# EasyEDA schematic RC-CAR-Rx.json
TITLE: Sheet_1; REV: 1.0; Date: 2025-01-02; Sheet: 1/1; Drawn By: harsh2003; Company: Your Company
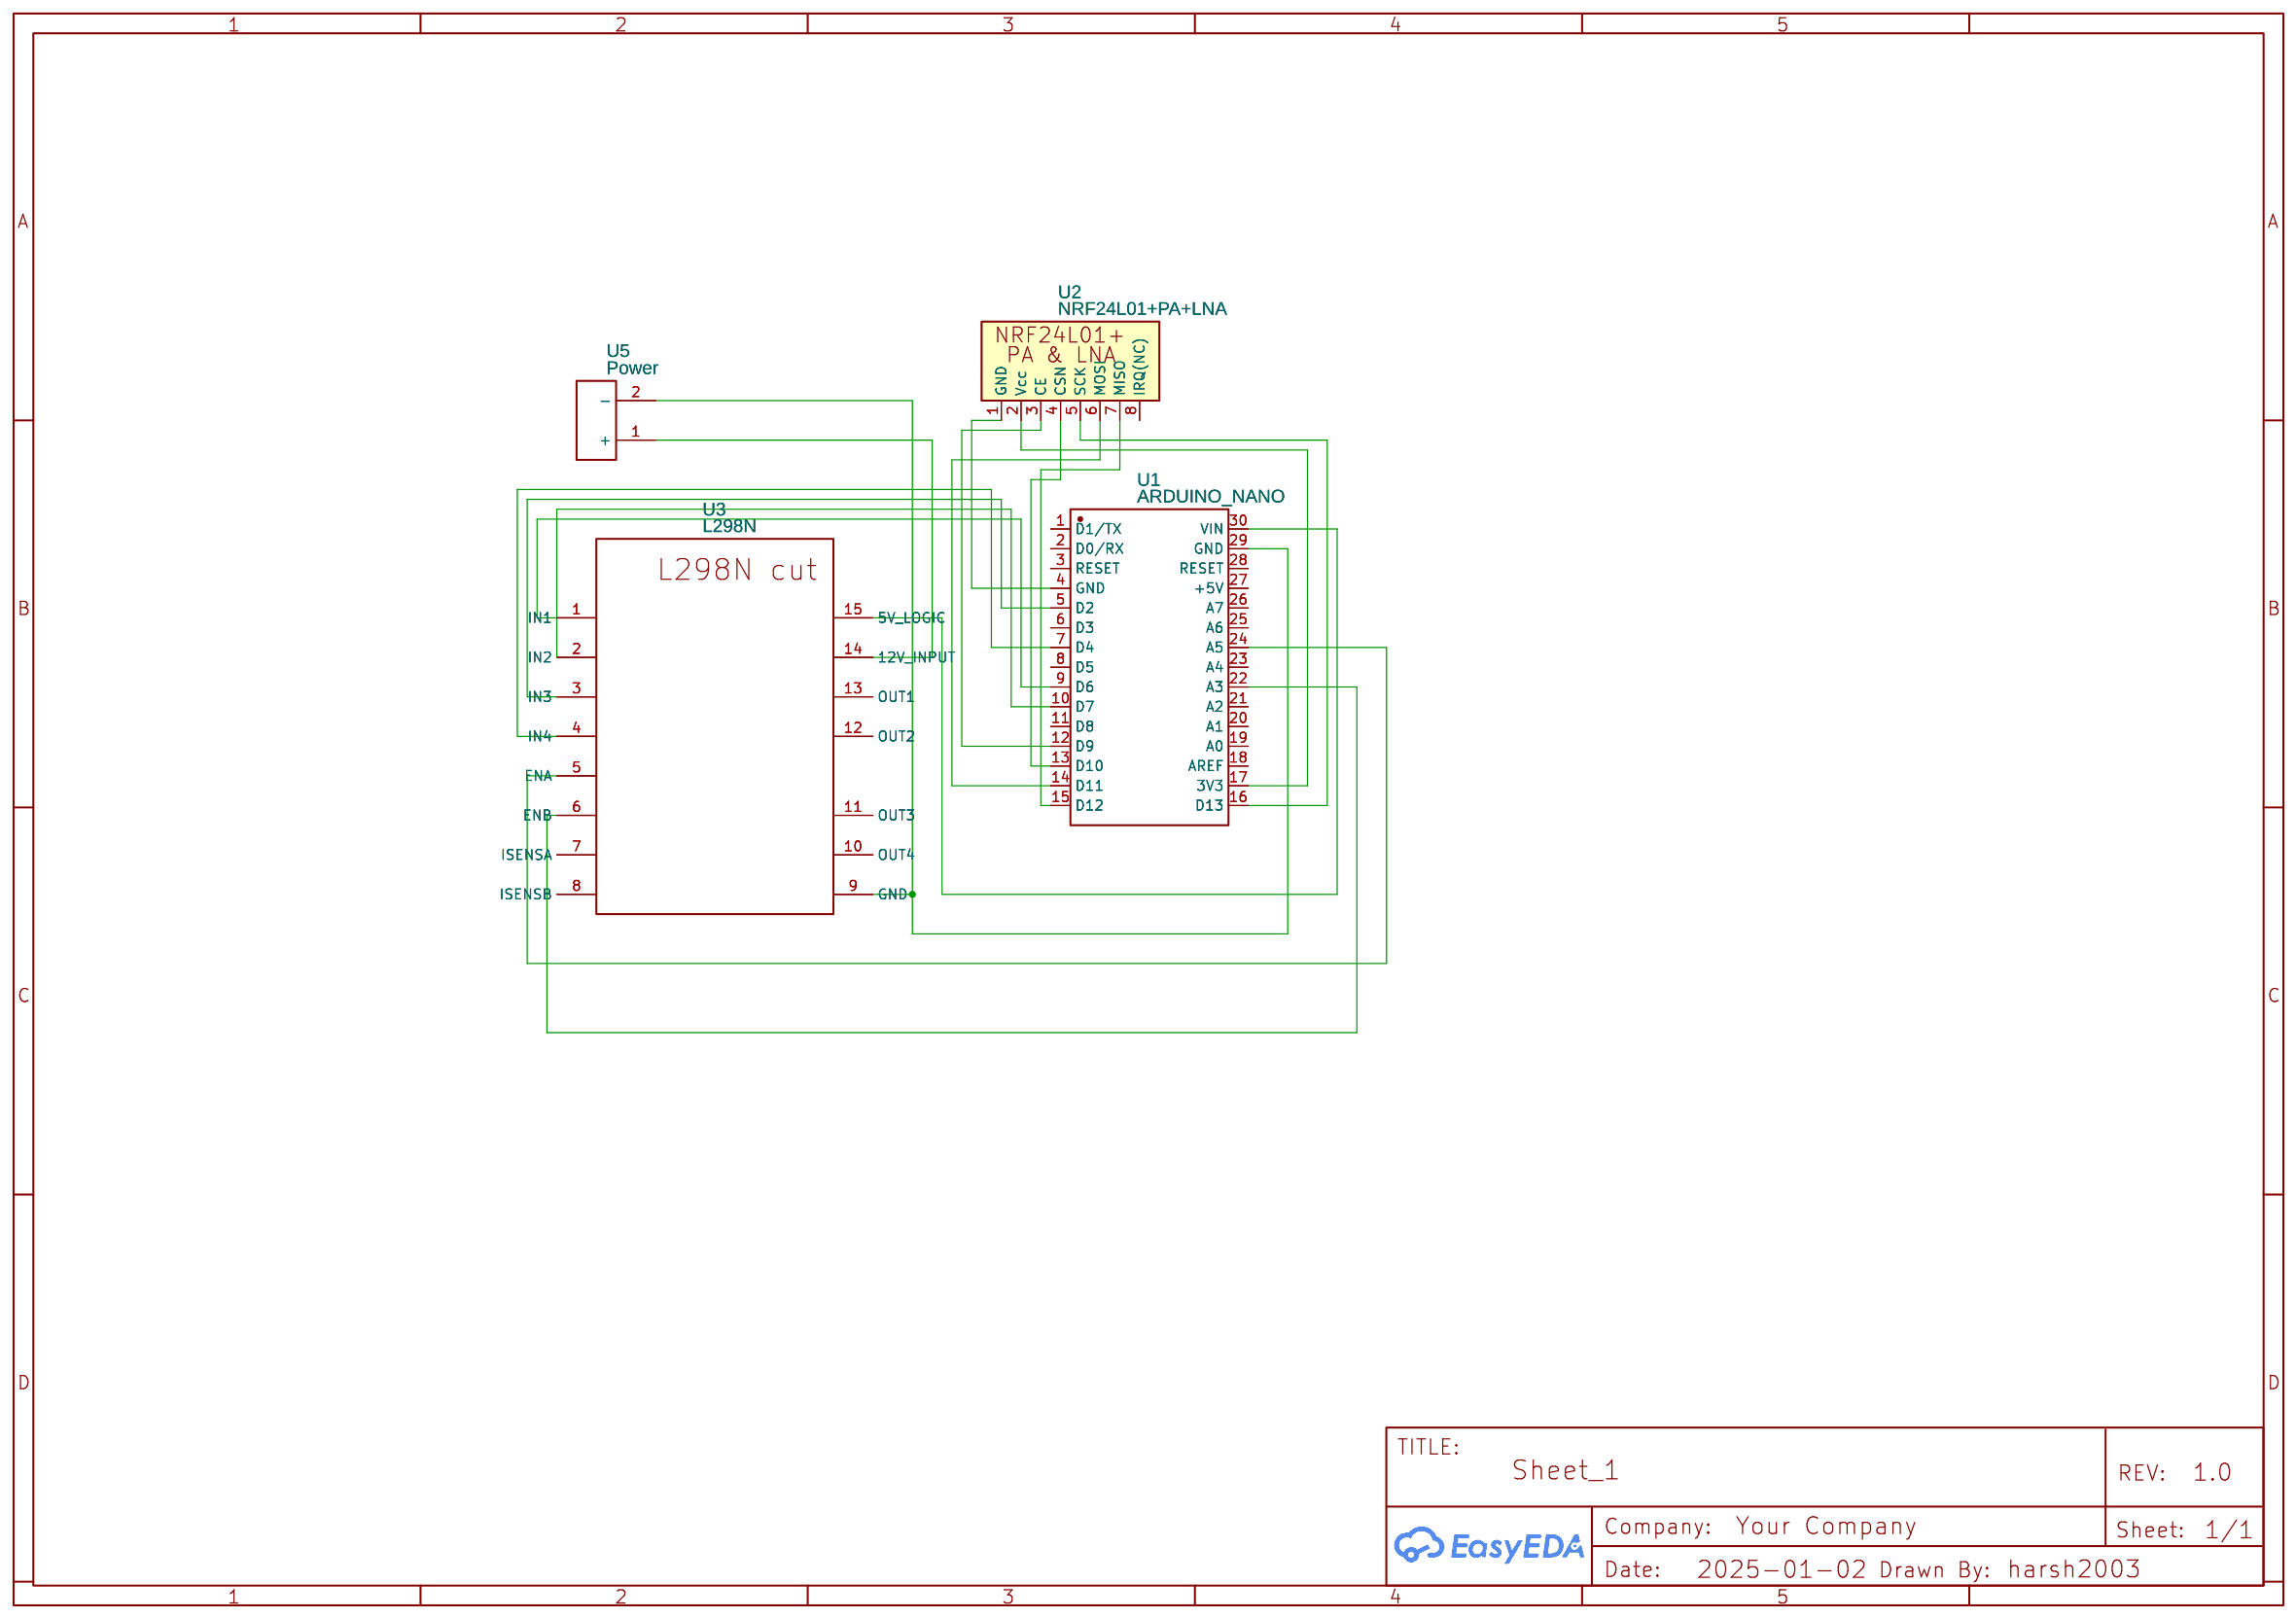
[diagram p0: schematic sheet]

## Parts
U1  ARDUINO_NANO  [COMM-TH_ARDUINO_NANO]
U2  NRF24L01+PA+LNA  [NRF24L01+PA+LNA_PCB]
U3  L298N  [L298N_2]
U5  Power  [RPIUSBPOWERCONNECTOR]

## Library data of the parts
U1 = ARDUINO_NANO: Contributor: lcsc; Supplier: LCSC; Supplier Part: C9900017879; Manufacturer: null; JLCPCB Part Class: Extended Part
U2 = AR_NRF24L01+PA+LNA: Manufacturer Part: NRF24L01+; Contributor: ar43; Manufacturer: Fo2sh
U3 = cutl298: Contributor: andrea.arcarisi
U5 = RpiPowerUSBcableConnector: Contributor: CasuallyLoadedH

## Nets
Net-(U1-4): U1.4(GND) U2.1(GND)
Net-(U1-5): U1.5(D2) U3.3(IN3)
Net-(U1-7): U1.7(D4) U3.4(IN4)
Net-(U1-9): U1.9(D6) U3.1(IN1)
Net-(U1-10): U1.10(D7) U3.2(IN2)
Net-(U1-12): U1.12(D9) U2.3(CE)
Net-(U1-13): U1.13(D10) U2.4(CSN)
Net-(U1-14): U1.14(D11) U2.6(MOSI)
Net-(U1-15): U1.15(D12) U2.7(MISO)
Net-(U1-16): U1.16(D13) U2.5(SCK)
Net-(U1-17): U1.17(3V3) U2.2(Vcc)
Net-(U1-22): U1.22(A3) U3.6(ENB)
Net-(U1-24): U1.24(A5) U3.5(ENA)
Net-(U1-29): U1.29(GND) U3.9(GND) U5.2(-)
Net-(U1-30): U1.30(VIN) U3.15(5V LOGIC)
Net-(U3-14): U3.14(12V INPUT) U5.1(+)

Not connected (* = marked no-connect by the designer): U1 1(D1/TX) 2(D0/RX) 3(RESET) 6(D3) 8(D5) 11(D8) 18(AREF) 19(A0) 20(A1) 21(A2) 23(A4) 25(A6) 26(A7) 27(+5V) 28(RESET); U2 8(IRQ(NC)); U3 7(ISENSA) 8(ISENSB) 10(OUT4) 11(OUT3) 12(OUT2) 13(OUT1)
